# EAGLE schematic op_amp_brd (EAGLE 9.3.0)
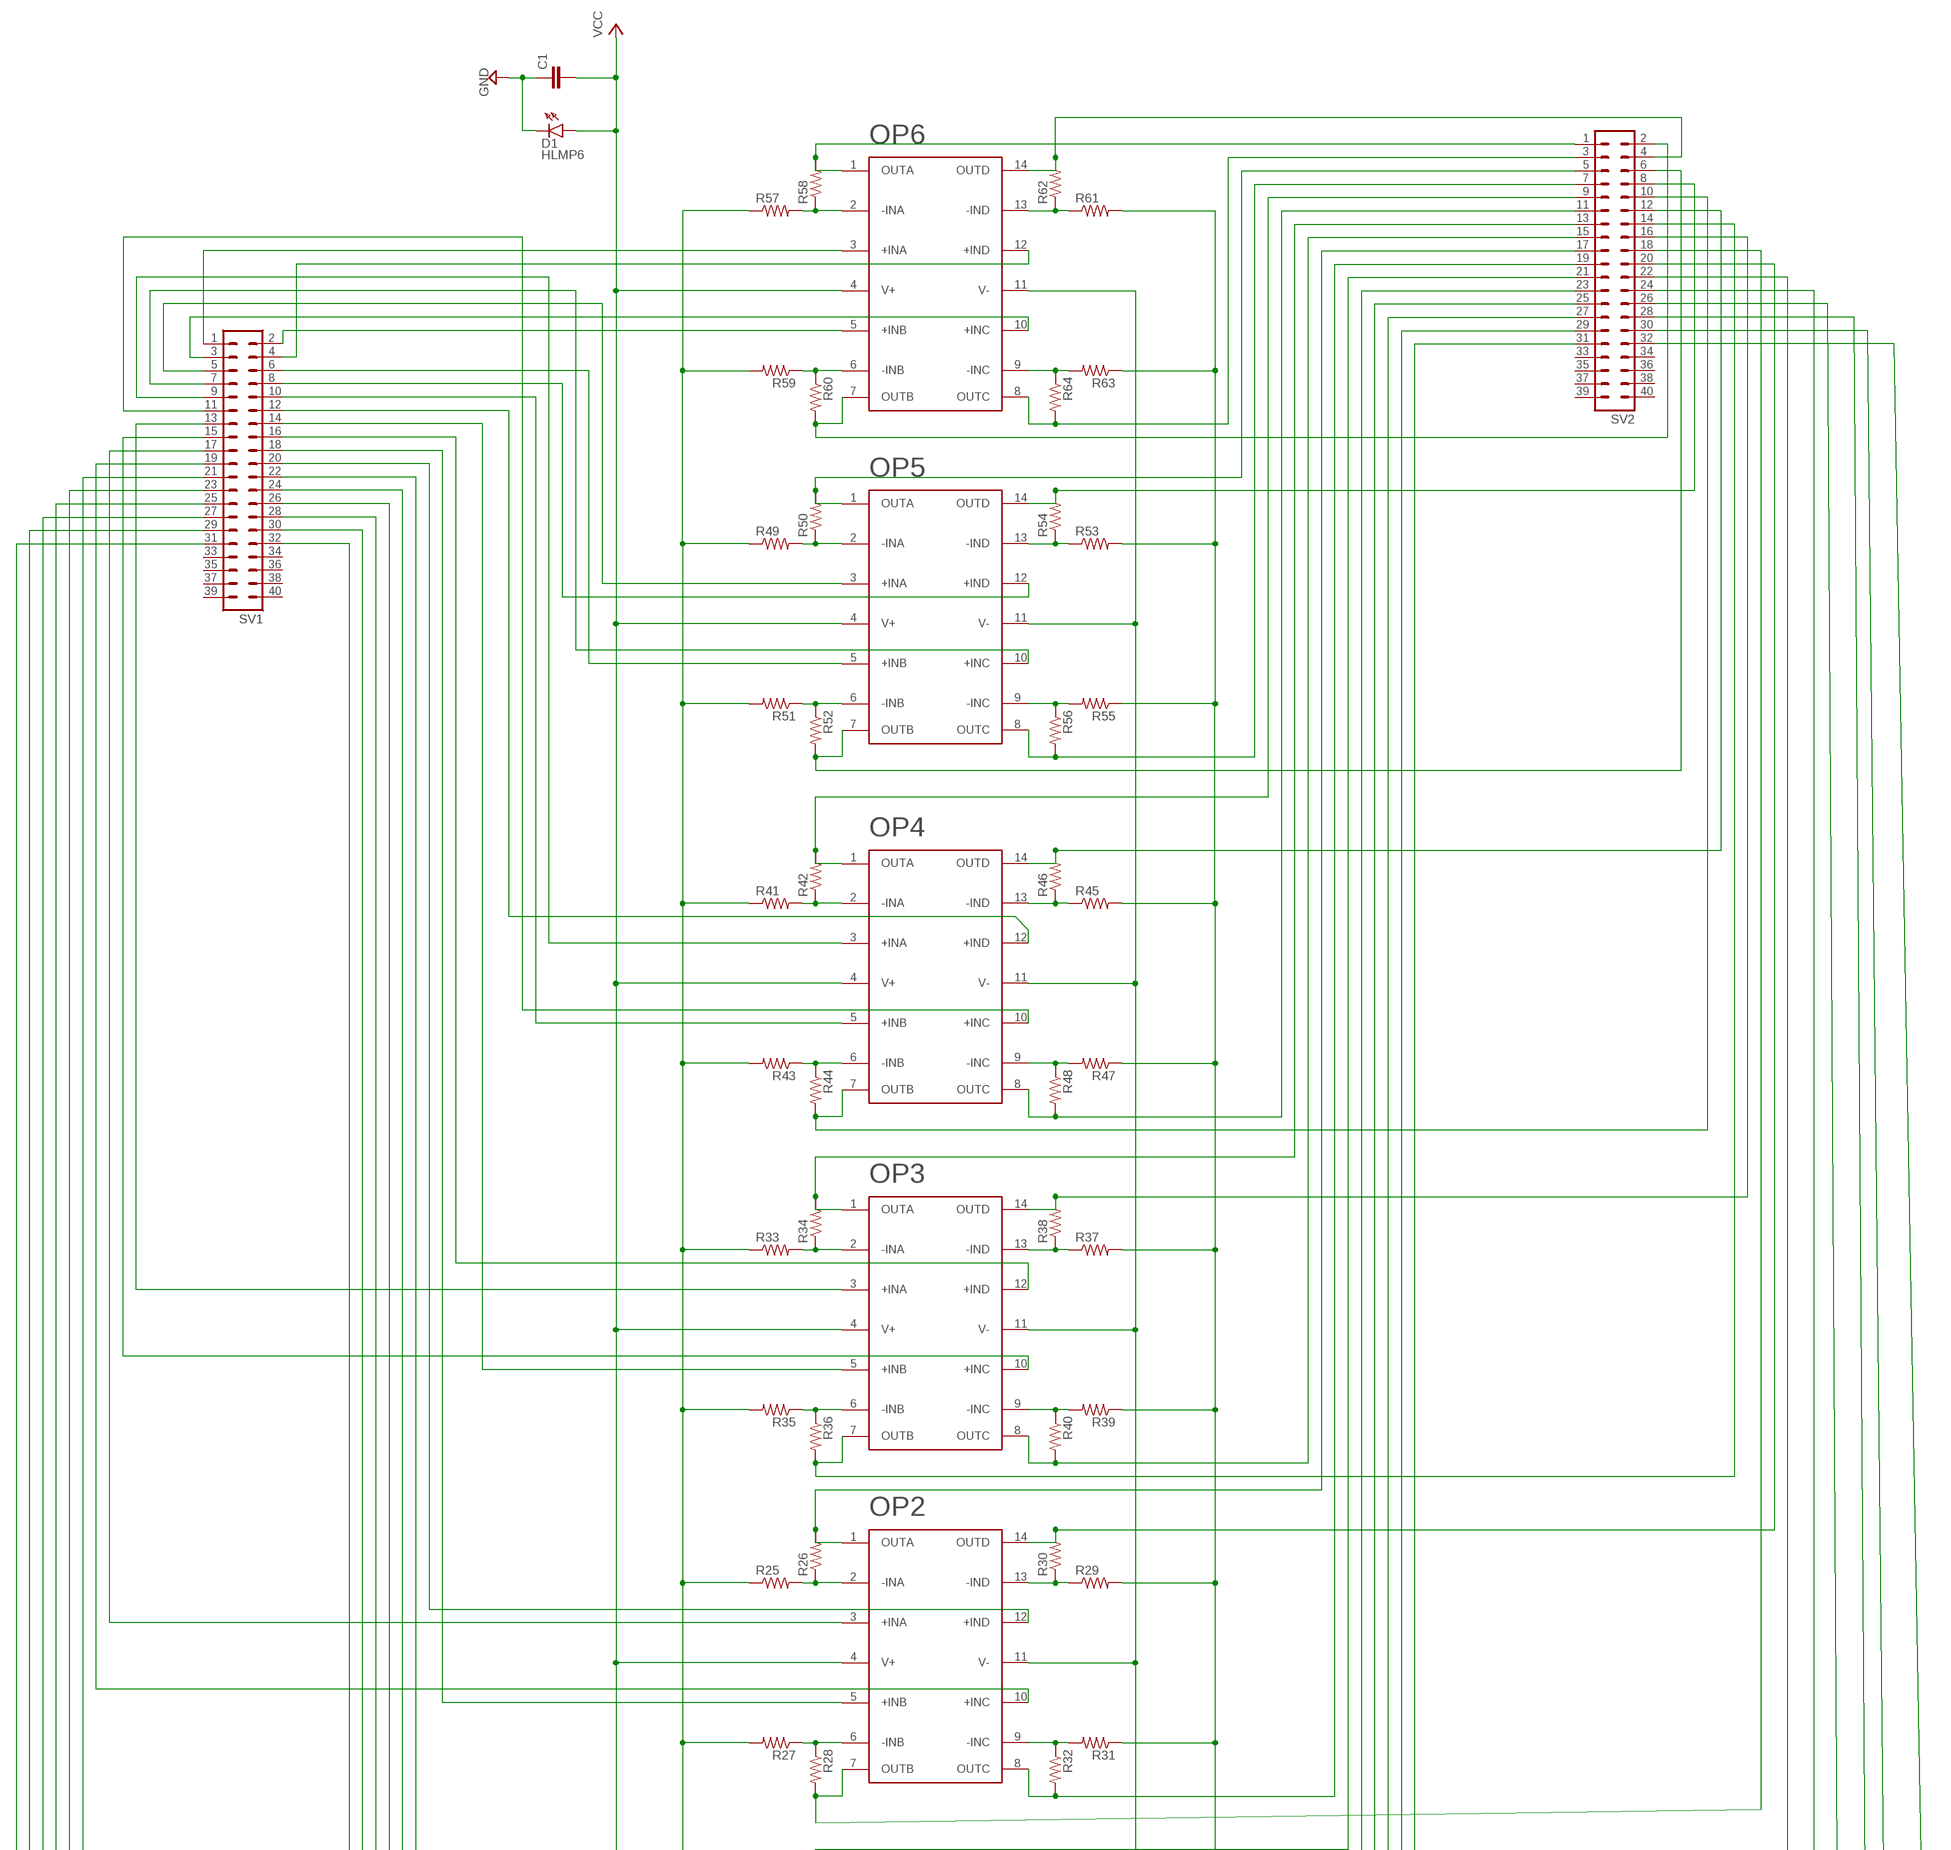
[diagram p0: schematic, sheet 1, part 1 of 2]
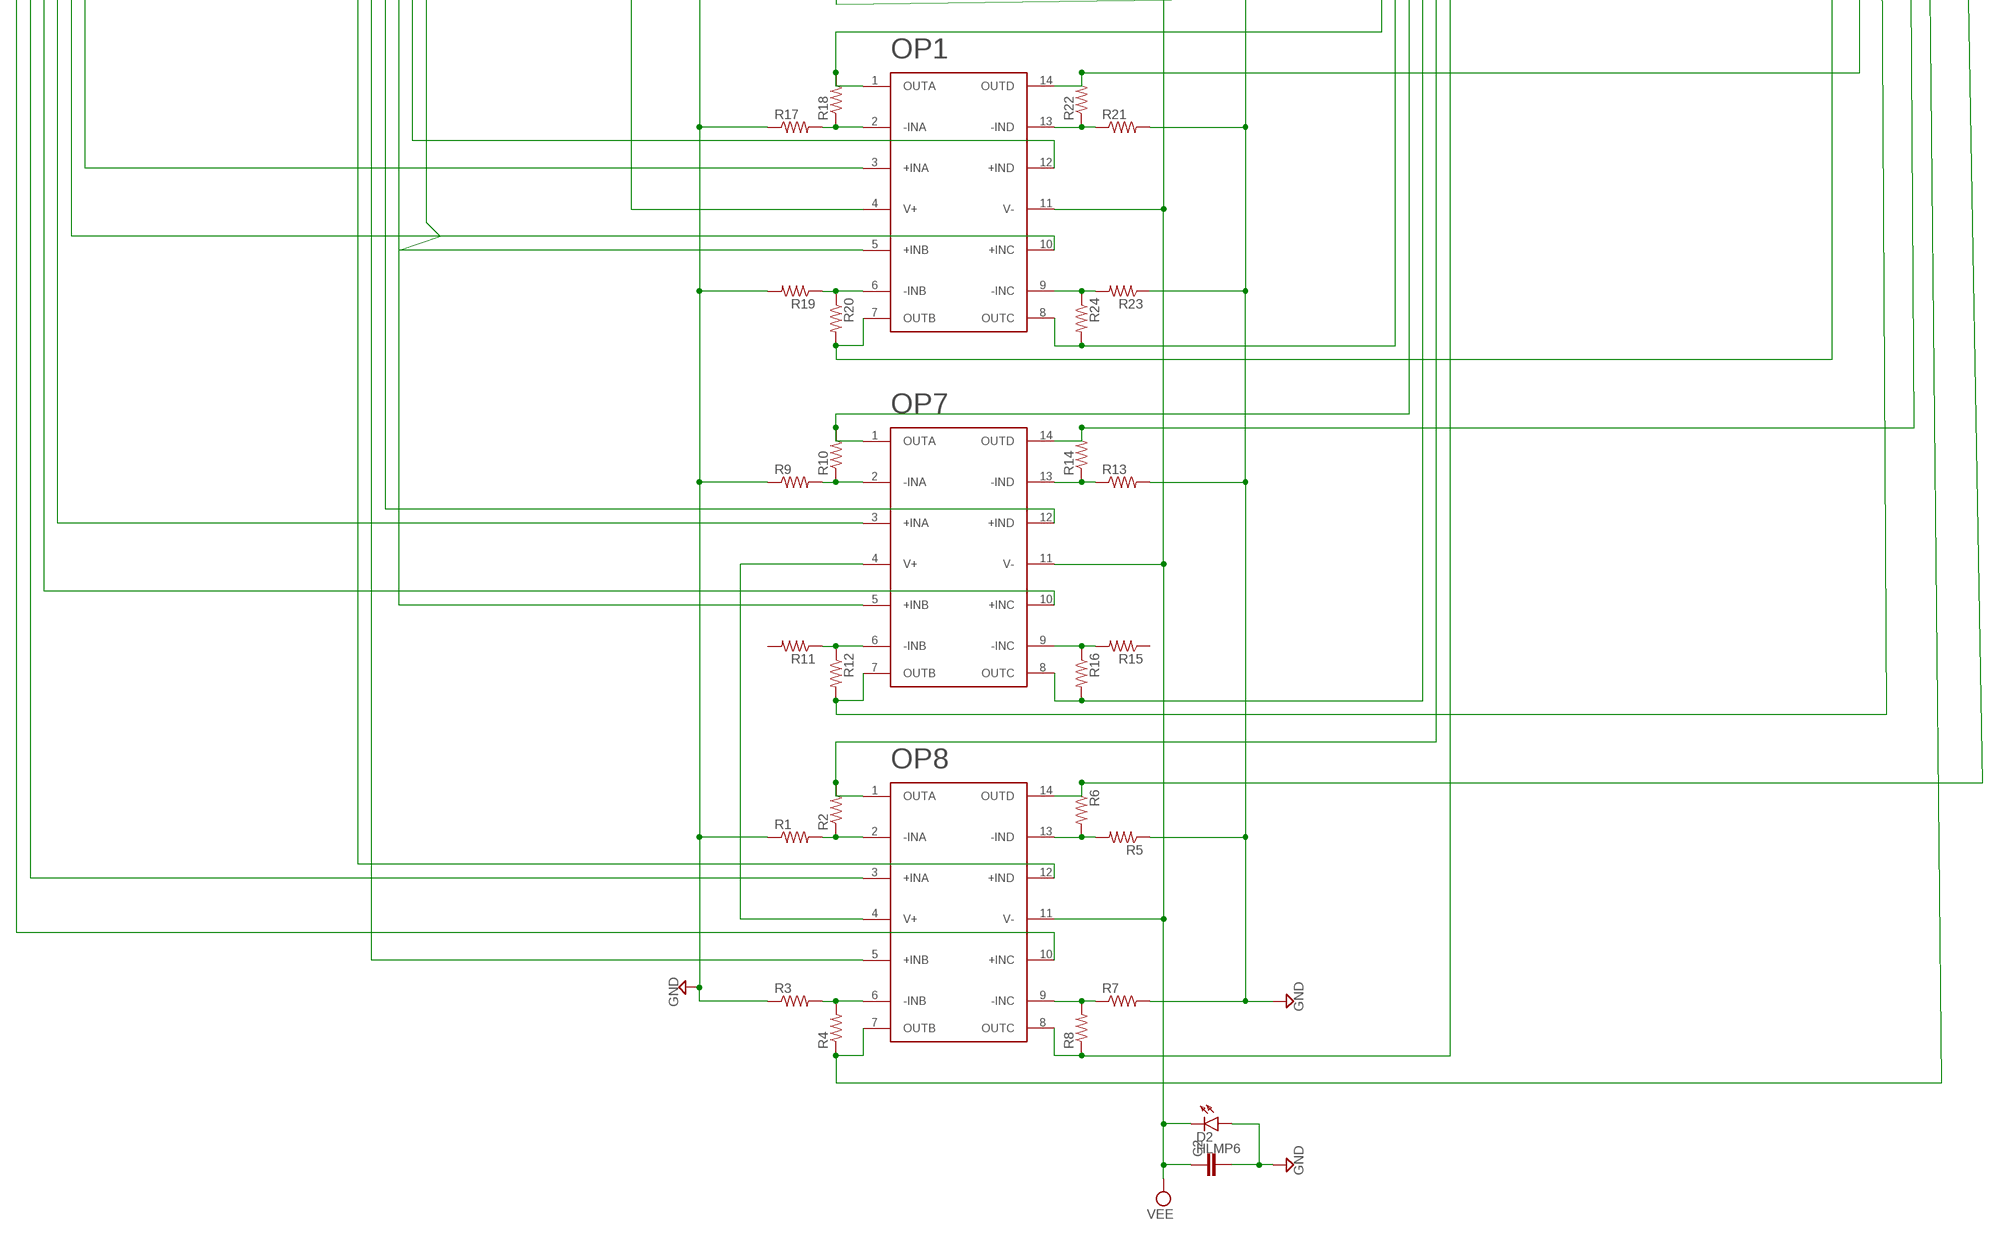
[diagram p1: schematic, sheet 1, part 2 of 2]

## Parts
C1  C2,5-3  [C2.5-3]
C2  C2,5-3  [C2.5-3]
D1  HLMP6  [HLMP6]
D2  HLMP6  [HLMP6]
OP1  OPAX4172  [OPAX172]
OP2  OPAX4172  [OPAX172]
OP3  OPAX4172  [OPAX172]
OP4  OPAX4172  [OPAX172]
OP5  OPAX4172  [OPAX172]
OP6  OPAX4172  [OPAX172]
OP7  OPAX4172  [OPAX172]
OP8  OPAX4172  [OPAX172]
R1  R-US_0204/2V  [0204V]
R2  R-US_0204/2V  [0204V]
R3  R-US_0204/2V  [0204V]
R4  R-US_0204/2V  [0204V]
R5  R-US_0204/2V  [0204V]
R6  R-US_0204/2V  [0204V]
R7  R-US_0204/2V  [0204V]
R8  R-US_0204/2V  [0204V]
R9  R-US_0204/2V  [0204V]
R10  R-US_0204/2V  [0204V]
R11  R-US_0204/2V  [0204V]
R12  R-US_0204/2V  [0204V]
R13  R-US_0204/2V  [0204V]
R14  R-US_0204/2V  [0204V]
R15  R-US_0204/2V  [0204V]
R16  R-US_0204/2V  [0204V]
R17  R-US_0204/2V  [0204V]
R18  R-US_0204/2V  [0204V]
R19  R-US_0204/2V  [0204V]
R20  R-US_0204/2V  [0204V]
R21  R-US_0204/2V  [0204V]
R22  R-US_0204/2V  [0204V]
R23  R-US_0204/2V  [0204V]
R24  R-US_0204/2V  [0204V]
R25  R-US_0204/2V  [0204V]
R26  R-US_0204/2V  [0204V]
R27  R-US_0204/2V  [0204V]
R28  R-US_0204/2V  [0204V]
R29  R-US_0204/2V  [0204V]
R30  R-US_0204/2V  [0204V]
R31  R-US_0204/2V  [0204V]
R32  R-US_0204/2V  [0204V]
R33  R-US_0204/2V  [0204V]
R34  R-US_0204/2V  [0204V]
R35  R-US_0204/2V  [0204V]
R36  R-US_0204/2V  [0204V]
R37  R-US_0204/2V  [0204V]
R38  R-US_0204/2V  [0204V]
R39  R-US_0204/2V  [0204V]
R40  R-US_0204/2V  [0204V]
R41  R-US_0204/2V  [0204V]
R42  R-US_0204/2V  [0204V]
R43  R-US_0204/2V  [0204V]
R44  R-US_0204/2V  [0204V]
R45  R-US_0204/2V  [0204V]
R46  R-US_0204/2V  [0204V]
R47  R-US_0204/2V  [0204V]
R48  R-US_0204/2V  [0204V]
R49  R-US_0204/2V  [0204V]
R50  R-US_0204/2V  [0204V]
R51  R-US_0204/2V  [0204V]
R52  R-US_0204/2V  [0204V]
R53  R-US_0204/2V  [0204V]
R54  R-US_0204/2V  [0204V]
R55  R-US_0204/2V  [0204V]
R56  R-US_0204/2V  [0204V]
R57  R-US_0204/2V  [0204V]
R58  R-US_0204/2V  [0204V]
R59  R-US_0204/2V  [0204V]
R60  R-US_0204/2V  [0204V]
R61  R-US_0204/2V  [0204V]
R62  R-US_0204/2V  [0204V]
R63  R-US_0204/2V  [0204V]
R64  R-US_0204/2V  [0204V]
SV1  MA20-2  [MA20-2]
SV2  MA20-2W  [MA20-2W]

## Nets
GND: C1.1 C2.2 D1.K D2.A R1.1 R3.1 R5.1 R7.2 R9.1 R13.2 R17.1 R19.2 R21.2 R23.1 R25.1 R27.2 R29.2 R31.1 R33.1 R35.2 R37.2 R39.1 R41.1 R43.2 R45.2 R47.1 R49.1 R51.2 R53.2 R55.1 R57.1 R59.2 R61.2 R63.1
N$1: OP8.2(-INA) R1.2 R2.1
N$2: OP8.1(OUTA) R2.2 SV2.29
N$3: OP8.13(-IND) R5.2 R6.2
N$4: OP8.14(OUTD) R6.1 SV2.32
N$5: OP8.6(-INB) R3.2 R4.2
N$6: OP8.7(OUTB) R4.1 SV2.30
N$7: OP8.9(-INC) R7.1 R8.2
N$8: OP8.8(OUTC) R8.1 SV2.31
N$9: OP7.2(-INA) R9.2 R10.1
N$10: OP7.1(OUTA) R10.2 SV2.25
N$11: OP7.6(-INB) R11.1 R12.1
N$12: OP7.7(OUTB) R12.2 SV2.26
N$13: OP7.9(-INC) R15.2 R16.1
N$14: OP7.8(OUTC) R16.2 SV2.27
N$15: OP7.13(-IND) R13.1 R14.1
N$16: OP7.14(OUTD) R14.2 SV2.28
N$17: OP7.4(V+) OP8.4(V+)
N$18: OP1.2(-INA) R17.2 R18.1
N$19: OP1.1(OUTA) R18.2 SV2.21
N$20: OP1.6(-INB) R19.1 R20.1
N$22: OP1.9(-INC) R23.2 R24.1
N$23: OP1.8(OUTC) R24.2 SV2.23
N$24: OP1.13(-IND) R21.1 R22.1
N$25: OP1.14(OUTD) R22.2 SV2.24
N$26: OP2.2(-INA) R25.2 R26.1
N$27: OP2.1(OUTA) R26.2 SV2.17
N$28: OP2.6(-INB) R27.1 R28.1
N$29: OP2.7(OUTB) R28.2 SV2.18
N$30: OP2.9(-INC) R31.2 R32.1
N$31: OP2.8(OUTC) R32.2 SV2.19
N$32: OP2.13(-IND) R29.1 R30.1
N$33: OP2.14(OUTD) R30.2 SV2.20
N$34: OP3.2(-INA) R33.2 R34.1
N$35: OP3.1(OUTA) R34.2 SV2.13
N$36: OP3.6(-INB) R35.1 R36.1
N$37: OP3.7(OUTB) R36.2 SV2.14
N$38: OP3.9(-INC) R39.2 R40.1
N$39: OP3.8(OUTC) R40.2 SV2.15
N$40: OP3.13(-IND) R37.1 R38.1
N$41: OP3.14(OUTD) R38.2 SV2.16
N$42: OP4.2(-INA) R41.2 R42.1
N$43: OP4.1(OUTA) R42.2 SV2.9
N$44: OP4.6(-INB) R43.1 R44.1
N$45: OP4.7(OUTB) R44.2 SV2.10
N$46: OP4.9(-INC) R47.2 R48.1
N$47: OP4.8(OUTC) R48.2 SV2.11
N$48: OP4.13(-IND) R45.1 R46.1
N$49: OP4.14(OUTD) R46.2 SV2.12
N$50: OP5.2(-INA) R49.2 R50.1
N$51: OP5.1(OUTA) R50.2 SV2.5
N$52: OP5.6(-INB) R51.1 R52.1
N$53: OP5.7(OUTB) R52.2 SV2.6
N$54: OP5.9(-INC) R55.2 R56.1
N$55: OP5.8(OUTC) R56.2 SV2.7
N$56: OP5.13(-IND) R53.1 R54.1
N$57: OP5.14(OUTD) R54.2 SV2.8
N$58: OP6.2(-INA) R57.2 R58.1
N$59: OP6.1(OUTA) R58.2 SV2.1
N$60: OP6.6(-INB) R59.1 R60.1
N$61: OP6.7(OUTB) R60.2 SV2.2
N$62: OP6.9(-INC) R63.2 R64.1
N$63: OP6.8(OUTC) R64.2 SV2.3
N$64: OP6.13(-IND) R61.1 R62.1
N$65: OP6.14(OUTD) R62.2 SV2.4
N$66: OP6.5(+INB) SV1.2
N$67: OP6.10(+INC) SV1.3
N$68: OP6.12(+IND) SV1.4
N$69: OP5.3(+INA) SV1.5
N$70: OP5.5(+INB) SV1.6
N$71: OP6.3(+INA) SV1.1
N$72: OP5.10(+INC) SV1.7
N$73: OP5.12(+IND) SV1.8
N$74: OP4.3(+INA) SV1.9
N$75: OP4.5(+INB) SV1.10
N$76: OP4.10(+INC) SV1.11
N$77: OP4.12(+IND) SV1.12
N$78: OP3.3(+INA) SV1.13
N$79: OP3.5(+INB) SV1.14
N$80: OP3.10(+INC) SV1.15
N$81: OP3.12(+IND) SV1.16
N$82: OP2.3(+INA) SV1.17
N$83: OP2.5(+INB) SV1.18
N$84: OP2.10(+INC) SV1.19
N$85: OP2.12(+IND) SV1.20
N$86: OP1.3(+INA) SV1.21
N$87: OP1.5(+INB) SV1.22
N$88: OP1.10(+INC) SV1.23
N$89: OP1.12(+IND) SV1.24
N$90: OP7.3(+INA) SV1.25
N$91: OP7.5(+INB) SV1.26
N$92: OP7.10(+INC) SV1.27
N$93: OP7.12(+IND) SV1.28
N$94: OP8.3(+INA) SV1.29
N$95: OP8.5(+INB) SV1.30
N$96: OP8.10(+INC) SV1.31
N$97: OP8.12(+IND) SV1.32
N$98: OP1.7(OUTB) R20.2 SV2.22
VCC: C1.2 D1.A OP1.4(V+) OP2.4(V+) OP3.4(V+) OP4.4(V+) OP5.4(V+) OP6.4(V+)
VEE: C2.1 D2.K OP1.11(V-) OP2.11(V-) OP3.11(V-) OP4.11(V-) OP5.11(V-) OP6.11(V-) OP7.11(V-) OP8.11(V-)
Unconnected: R11.2 R15.1 SV1.33 SV1.34 SV1.35 SV1.36 SV1.37 SV1.38 SV1.39 SV1.40 SV2.33 SV2.34 SV2.35 SV2.36 SV2.37 SV2.38 SV2.39 SV2.40

## Library data of the parts
C1 C2 = capacitor-wima:C: CAPACITOR naming: grid - package width
D1 D2 = display-hp:HLMP6: LED 2mm horizontal; MF: AGILENT TECHNOLOGIES; MPN: HLMP-6500; OC_FARNELL: 1652490; OC_NEWARK: 40K0088
OP1-OP8 = OPA4172IDR:OPAX4172
R1-R64 = rcl:R-US_: RESISTOR, American symbol; SPICEPREFIX: R
SV1 = con-lstb:MA20-2: PIN HEADER; OC_FARNELL: unknown; OC_NEWARK: unknown
SV2 = con-lstb:MA20-2W: PIN HEADER; OC_FARNELL: unknown; OC_NEWARK: unknown